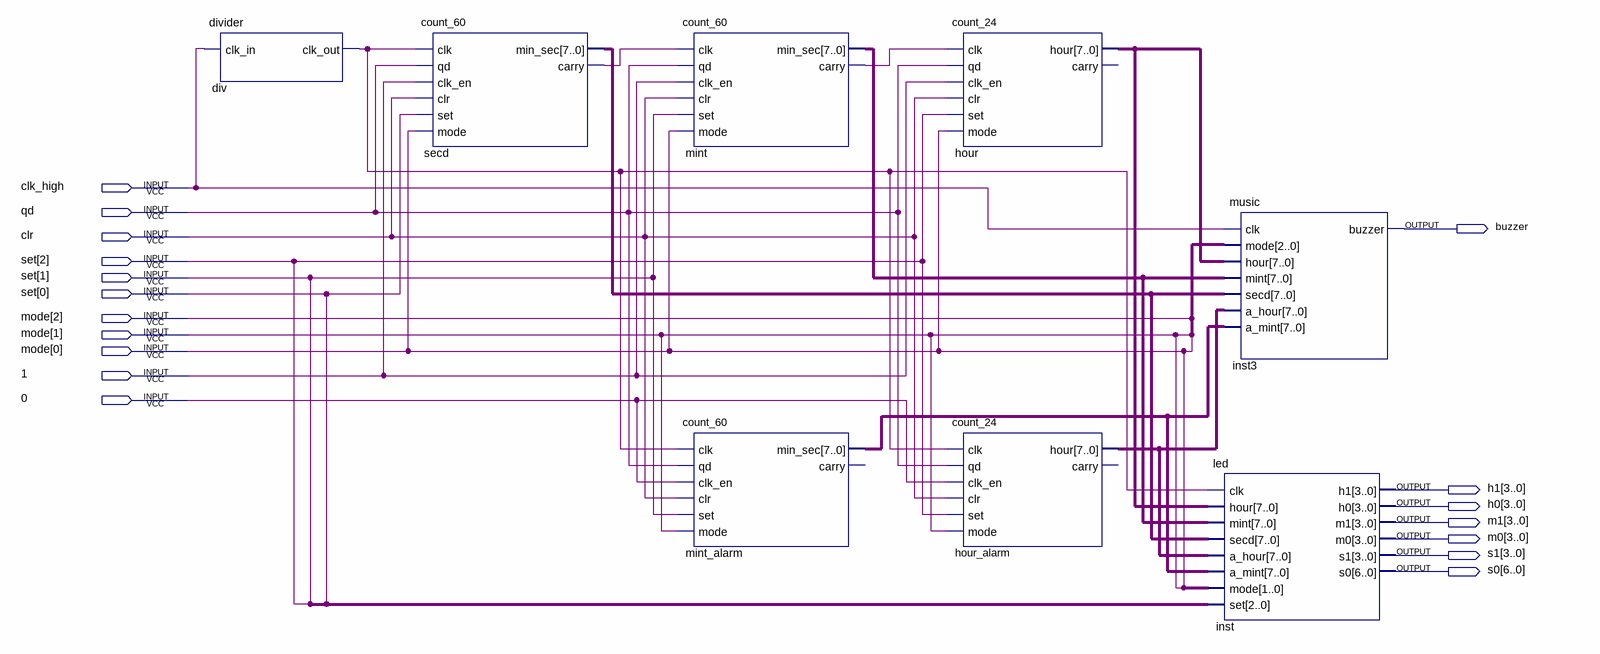
[diagram p0: schematic sheet]
// Quartus schematic design.bdf as structural Verilog: 8 symbols, 18 pins
module \design  (
  input  clk_high,
  input  qd,
  input  clr,
  input  [2:0] set,
  input  [2:0] mode,
  input  \1 ,
  input  \0 ,
  output buzzer,
  output [3:0] h1,
  output [3:0] h0,
  output [3:0] m1,
  output [3:0] m0,
  output [3:0] s1,
  output [6:0] s0
);

  wire div_clk_out, mint_carry, secd_carry;
  wire [1:0] undriven_2;
  wire [2:0] undriven, undriven_3;
  wire [7:0] hour_alarm_hour, hour_hour, mint_alarm_min_sec, mint_min_sec, secd_min_sec;

  divider div (.clk_in(clk_high), .clk_out(div_clk_out));
  count_60 secd (
    .clk(div_clk_out), .qd(qd), .clk_en(\1 ), .clr(clr), .set(set[0]), .mode(mode[0]),
    .min_sec(secd_min_sec), .carry(secd_carry));
  count_60 mint (
    .clk(secd_carry), .qd(qd), .clk_en(\1 ), .clr(clr), .set(set[1]), .mode(mode[0]), .min_sec(mint_min_sec),
    .carry(mint_carry));
  count_60 mint_alarm (
    .clk(div_clk_out), .qd(qd), .clk_en(\0 ), .clr(clr), .set(set[1]), .mode(mode[1]),
    .min_sec(mint_alarm_min_sec));  // open: carry
  count_24 hour (
    .clk(mint_carry), .qd(qd), .clk_en(\1 ), .clr(clr), .set(set[2]), .mode(mode[0]), .hour(hour_hour));  // open: carry
  count_24 hour_alarm (
    .clk(div_clk_out), .qd(qd), .clk_en(\0 ), .clr(clr), .set(set[2]), .mode(mode[1]), .hour(hour_alarm_hour));  // open: carry
  music inst3 (
    .clk(clk_high), .mode(undriven), .hour(hour_hour), .mint(mint_min_sec), .secd(secd_min_sec),
    .a_hour(hour_alarm_hour), .a_mint(mint_alarm_min_sec), .buzzer(buzzer));
  led inst (
    .clk(div_clk_out), .hour(hour_hour), .mint(mint_min_sec), .secd(secd_min_sec), .a_hour(hour_alarm_hour),
    .a_mint(mint_alarm_min_sec), .mode(undriven_2), .set(undriven_3), .h1(h1), .h0(h0), .m1(m1), .m0(m0),
    .s1(s1), .s0(s0));
endmodule
